# EAGLE board robotsm20-linefollower (EAGLE 9.6.0)
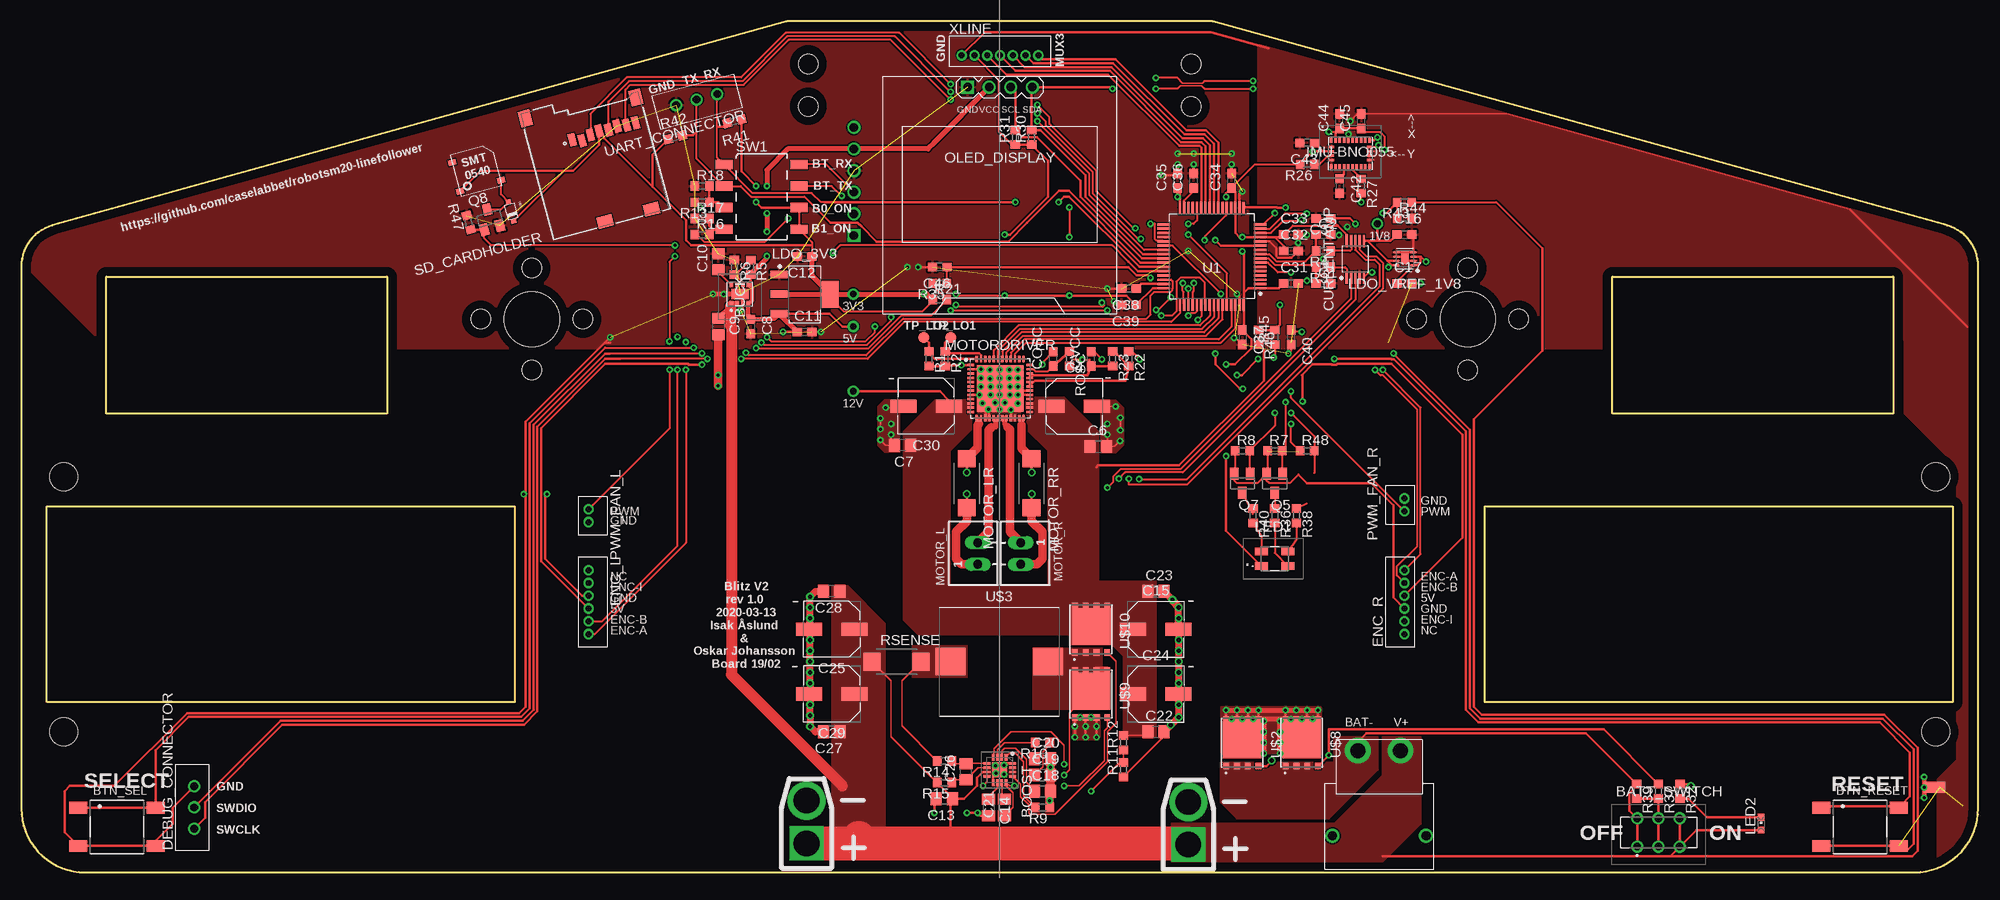
[diagram p4: board, top side]
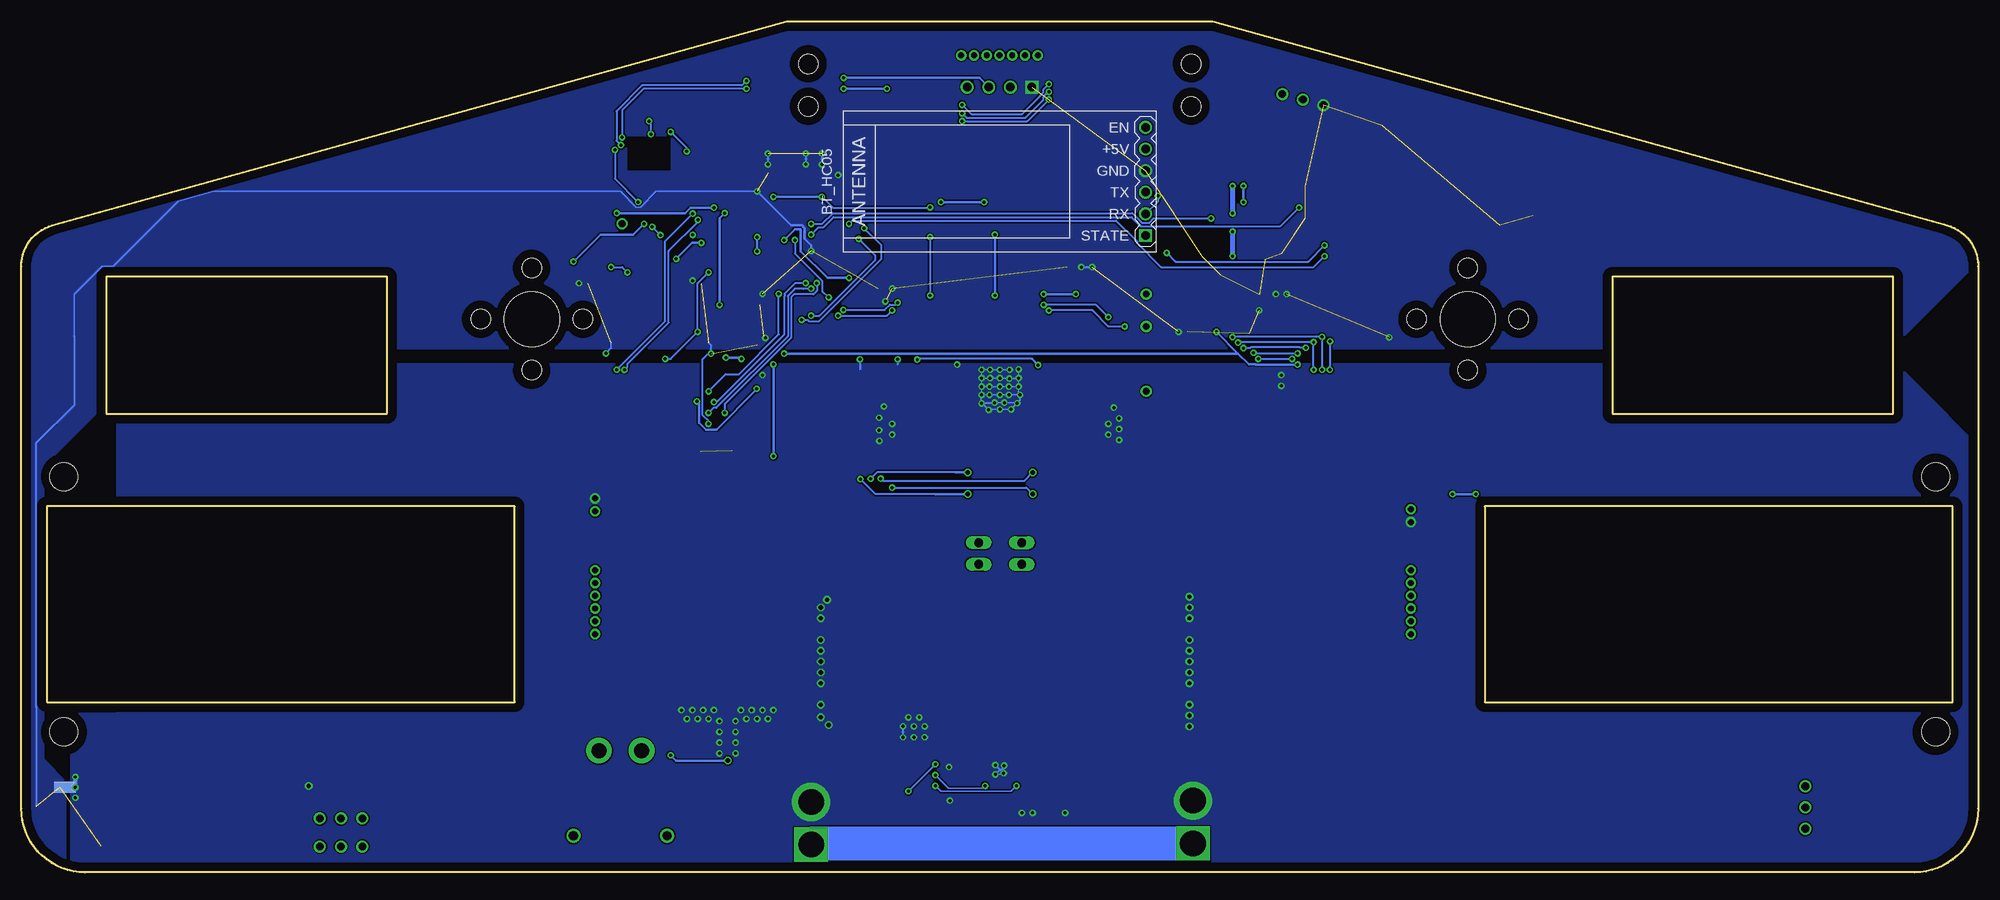
[diagram p5: board, bottom side, seen from below]

Size 230 x 100 mm. Coordinates in mm from the lower left corner, seen from the top.
Outline: 3.66,76.02 arc74 0,71.2 0,7.5 arc90 7.5,0 222.5,0 arc90 230,7.5 230,71.2 arc74 226.34,76.02 140,100 90,100 3.66,76.02
Outline: 58,20 3,20 3,43 58,43 58,20
Outline: 10,53.9 10,70 43,70 43,53.9 10,53.9
Outline: 220,70 220,53.9 187,53.9 187,70 220,70
Outline: 227,43 227,20 172,20 172,43 227,43
Copper layers (1*16): Top 0.035mm / dielectric 1.5mm / Bottom 0.035mm
Design rules "default": minimum track width 6mil, minimum drill 0.35mm, track to track 6mil, track to pad 6mil, pad to pad 6mil, via to via 6mil, smd to smd 6mil, copper to edge 40mil, drill to drill 6mil, minimum pad ring 10mil, minimum via ring 8mil, stop-mask expansion 4mil, vias tented up to drill 0mil, thermal gap 10mil
Holes 3.3 mm at 5,46.5 225,16.5 5,16.5 225,46.5
Holes 2.3 mm at 164,65 92.5,90 137.5,90 170,59 170,71 92.5,95 176,65 137.5,95 54,65 66,65 60,59 60,71
Holes 6.5 mm at 170,65 60,65
tRestrict: area 154.4,83.4 to 158,85.5
bRestrict: area 153.7,82.5 to 158.8,86.4

## Footprints (pad centres in the part's own frame; a part is rotated, then mirrored left to right if it is on the bottom)
JS202011AQN = drill 0.9 pad 1.4: 1 -2.5,-1.425; 2 0,-1.425; 3 2.5,-1.425; 4 -2.5,1.875; 5 0,1.875; 6 2.5,1.875
QFN50P300X300X80-17N = smd 0.8 x 0.3: 1 -1.5,0.75; 2 -1.5,0.25; 3 -1.5,-0.25; 4 -1.5,-0.75; 9 1.5,-0.75; 10 1.5,-0.25; 11 1.5,0.25; 12 1.5,0.75 | smd 0.3 x 0.8: 5 -0.75,-1.5; 6 -0.25,-1.5; 7 0.25,-1.5; 8 0.75,-1.5; 13 0.75,1.5; 14 0.25,1.5; 15 -0.25,1.5; 16 -0.75,1.5 | smd 1.76 x 1.76: 17 0,0
WIRELESS-BLUETOOTH-HC-05 = drill 1 square: 1 -6.35,-17.145 | drill 1: 2 -3.81,-17.145; 3 -1.27,-17.145; 4 1.27,-17.145; 5 3.81,-17.145; 6 6.35,-17.145
TSM2JSMA = smd 2.1 x 1.4: 1 -4.55,2.25; 2 4.55,2.25; 3 -4.55,-2.25; 4 4.55,-2.25
TPS82130SILT = smd 0.51 x 0.41: 1 -1.05,0.975; 2 -1.05,0.325; 3 -1.05,-0.325; 4 -1.05,-0.975; 5 1.05,-0.975; 6 1.05,-0.325; 7 1.05,0.325; 8 1.05,0.975 | smd 1.2 x 2: 9 0,0
C0603 = smd 1.1 x 1: 1 -0.85,0; 2 0.85,0
CAPAE660X700N = smd 3.062 x 1.562: 1 -2.675,0; 2 2.675,0
C0805 = smd 1.3 x 1.5: 1 -0.95,0; 2 0.95,0
SOP50P490X110-10N = smd 1.471 x 0.28: 1 -2.15,1; 2 -2.15,0.5; 3 -2.15,0; 4 -2.15,-0.5; 5 -2.15,-1; 6 2.15,-1; 7 2.15,-0.5; 8 2.15,0; 9 2.15,0.5; 10 2.15,1
B3B-EH = drill 0.9: 1 -2.5,0; 2 0,0; 3 2.5,0
B6B-ZR = drill 0.7: 1 -3.75,0; 2 -2.25,0; 3 -0.75,0; 4 0.75,0; 5 2.25,0; 6 3.75,0
XT30 = drill 3 pad 4.5: NEG- 0,5 | drill 3 pad 4 square: POS+ 0,0
BNO055 = smd 0.3 x 0.6: 1 -2.25,1.55; 6 -2.25,-1.55; 7 -1.75,-1.55; 8 -1.25,-1.55; 9 -0.75,-1.55; 10 -0.25,-1.55; 11 0.25,-1.55; 12 0.75,-1.55; 13 1.25,-1.55; 14 1.75,-1.55; 15 2.25,-1.55; 20 2.25,1.55; 21 1.75,1.55; 22 1.25,1.55; 23 0.75,1.55; 24 0.25,1.55; 25 -0.25,1.55; 26 -0.75,1.55; 27 -1.25,1.55; 28 -1.75,1.55 | smd 0.6 x 0.3: 2 -2.25,0.75; 3 -2.25,0.25; 4 -2.25,-0.25; 5 -2.25,-0.75; 16 2.25,-0.75; 17 2.25,-0.25; 18 2.25,0.25; 19 2.25,0.75
SOT230P700X180-4 = smd 1.965 x 0.889: 1 -3.023,2.3; 2 -3.023,0; 3 -3.023,-2.3 | smd 1.965 x 3.189: 4 3.023,0
SON50P200X200X80-9T80X120N = smd 0.711 x 0.27: 1 -1.001,0.75; 2 -1.001,0.25; 3 -1.001,-0.25; 4 -1.001,-0.75; 5 1.001,-0.75; 6 1.001,-0.25; 7 1.001,0.25; 8 1.001,0.75 | smd 0.8 x 1.2: 9 0,0
150141M173100 = smd 1.5 x 0.9: 1 1.55,0.85; 2 1.55,-0.85; 3 -1.55,0.85; 4 -1.55,-0.85
CHIPLED_0603 = smd 0.8 x 0.8: A 0,-0.75; C 0,0.75
JST-XH-02 = drill 1.016 long: 1 -1.27,0; 2 1.27,0
R2512W = smd 2 x 2.1: 1 -2.896,0; 2 2.896,0
QFN50P700X700X100-49T550N = smd 0.761 x 0.27: 1 -3.476,2.75; 2 -3.476,2.25; 3 -3.476,1.75; 4 -3.476,1.25; 5 -3.476,0.75; 6 -3.476,0.25; 7 -3.476,-0.25; 8 -3.476,-0.75; 9 -3.476,-1.25; 10 -3.476,-1.75; 11 -3.476,-2.25; 12 -3.476,-2.75; 25 3.476,-2.75; 26 3.476,-2.25; 27 3.476,-1.75; 28 3.476,-1.25; 29 3.476,-0.75; 30 3.476,-0.25; 31 3.476,0.25; 32 3.476,0.75; 33 3.476,1.25; 34 3.476,1.75; 35 3.476,2.25; 36 3.476,2.75 | smd 0.27 x 0.761: 13 -2.75,-3.476; 14 -2.25,-3.476; 15 -1.75,-3.476; 16 -1.25,-3.476; 17 -0.75,-3.476; 18 -0.25,-3.476; 19 0.25,-3.476; 20 0.75,-3.476; 21 1.25,-3.476; 22 1.75,-3.476; 23 2.25,-3.476; 24 2.75,-3.476; 37 2.75,3.476; 38 2.25,3.476; 39 1.75,3.476; 40 1.25,3.476; 41 0.75,3.476; 42 0.25,3.476; 43 -0.25,3.476; 44 -0.75,3.476; 45 -1.25,3.476; 46 -1.75,3.476; 47 -2.25,3.476; 48 -2.75,3.476 | smd 5.5 x 5.5: 49 0,0
DISPLAY-OLED-128X64-I2C = drill 1 square: 1 -3.81,12.7 | drill 1: 2 -1.27,12.7; 3 1.27,12.7; 4 3.81,12.7
B2B-ZR = drill 0.7: 1 -0.75,0; 2 0.75,0
SOT23 = smd 1 x 1.4: 1 -0.95,-1.1; 2 0.95,-1.1; 3 0,1.1
R0603 = smd 1 x 1.1: 1 -0.85,0; 2 0.85,0
693071010811 = smd 0.8 x 1.5: 1 1.94,-3.1; 2 0.84,-2.7; 3 -0.26,-3.1; 4 -1.36,-3.3; 5 -2.46,-3.1; 6 -3.56,-3.3; 7 -4.66,-3.1; 8 -5.76,-3.1 | smd 1.4 x 1.9: 9 6.6,-6.95; 9-1 -6.55,-5.95 | smd 1.8 x 1.4: 10 0.7,7.2; 10-1 -4.95,7.2
DIPSWITCH_4P_SMD = smd 1.1 x 2: A1 -3.81,4.4; A2 -1.27,4.4; A3 1.27,4.4; A4 3.81,4.4; B1 -3.81,-4.4; B2 -1.27,-4.4; B3 1.27,-4.4; B4 3.81,-4.4
PAD_HOLE = drill 0.8: P$1 0,0
PAD.03X.05 = smd 1.27 x 1.27: P$1 0,0
LQFP-64 = smd 1.469 x 0.28: 1 -5.671,3.75; 2 -5.671,3.25; 3 -5.671,2.75; 4 -5.671,2.25; 5 -5.671,1.75; 6 -5.671,1.25; 7 -5.671,0.75; 8 -5.671,0.25; 9 -5.671,-0.25; 10 -5.671,-0.75; 11 -5.671,-1.25; 12 -5.671,-1.75; 13 -5.671,-2.25; 14 -5.671,-2.75; 15 -5.671,-3.25; 16 -5.671,-3.75; 33 5.671,-3.75; 34 5.671,-3.25; 35 5.671,-2.75; 36 5.671,-2.25; 37 5.671,-1.75; 38 5.671,-1.25; 39 5.671,-0.75; 40 5.671,-0.25; 41 5.671,0.25; 42 5.671,0.75; 43 5.671,1.25; 44 5.671,1.75; 45 5.671,2.25; 46 5.671,2.75; 47 5.671,3.25; 48 5.671,3.75 | smd 0.28 x 1.469: 17 -3.75,-5.671; 18 -3.25,-5.671; 19 -2.75,-5.671; 20 -2.25,-5.671; 21 -1.75,-5.671; 22 -1.25,-5.671; 23 -0.75,-5.671; 24 -0.25,-5.671; 25 0.25,-5.671; 26 0.75,-5.671; 27 1.25,-5.671; 28 1.75,-5.671; 29 2.25,-5.671; 30 2.75,-5.671; 31 3.25,-5.671; 32 3.75,-5.671; 49 3.75,5.671; 50 3.25,5.671; 51 2.75,5.671; 52 2.25,5.671; 53 1.75,5.671; 54 1.25,5.671; 55 0.75,5.671; 56 0.25,5.671; 57 -0.25,5.671; 58 -0.75,5.671; 59 -1.25,5.671; 60 -1.75,5.671; 61 -2.25,5.671; 62 -2.75,5.671; 63 -3.25,5.671; 64 -3.75,5.671
SMT-0540-S-R = smd 0.7 x 0.9: + 1.9,-2.4; - 1.9,2.6; DUMMY_LEAD -1.6,-2.4
Q5A = smd 0.75 x 0.675: 1 2.752,-1.905; 2 2.752,-0.635; 3 2.752,0.635; 4 2.752,1.905 | smd 0.655 x 0.675: 5 -2.8,1.905; 6 -2.8,0.635; 7 -2.8,-0.635; 8 -2.8,-1.893 | smd 4.295 x 4.51: 9 -0.325,0
INDM135125X330N = smd 3.533 x 3.21: 1 -5.736,0; 2 5.736,0
SPLITTER = smd 1.27 x 1.27: P$1 0,0.635; P$2 0,-0.635
1N4148WX_SOD-323-2 = smd 0.6 x 0.6: + -0.935,-0.035; - 1.365,-0.035
XT30PW-M = drill 1.8 pad 3: + -2.5,0; - 2.5,0 | drill 1.1: NC$1 5.5,10; NC$2 -5.5,10
B7B-ZR = drill 0.7: 1 -4.5,0; 2 -3,0; 3 -1.5,0; 4 0,0; 5 1.5,0; 6 3,0; 7 4.5,0

## Placement (x,y rotation side)
BATT_SWITCH  JS202011AQN  [JS202011AQN]  192.42,4.45 0 top
BOOST  TPS43061RTER  [QFN50P300X300X80-17N]  114.99,12.04 270 top
BT_HC05  WIRELESS-BLUETOOTH-HC-05  [WIRELESS-BLUETOOTH-HC-05]  115,81.18 90 bottom
BTN_RESET  TSM2JSMA  [TSM2JSMA]  216.1,5.35 0 top
BTN_SEL  TSM2JSMA  [TSM2JSMA]  11.23,5.35 0 top
BUCK  TPS82130SILT  [TPS82130SILT]  84.45,67.94 90 top
C1  4.7nF  [C0603]  153.03,69.22 0 top
C2  4.7nF  [C0603]  153.03,74.93 0 top
C3  0.1µF  [C0603]  153.03,76.83 180 top
C4  100uF  [CAPAE660X700N]  123.75,54.76 0 top
C6  0.1µF  [C0805]  126.58,50.04 0 top
C7  0.1µF  [C0805]  103.58,50.17 180 top
C8  10µF  [C0603]  85.72,64.14 270 top
C9  22µF  [C0805]  81.92,64.14 270 top
C10  3300pF  [C0805]  81.92,71.75 90 top
C11  10µF  [C0603]  92.08,63.5 0 top
C12  10µF  [C0603]  92.08,72.39 180 top
C13  0.1µF  [C0805]  108.48,8.64 180 top
C14  4.7µF  [C0805]  113.67,7.62 270 top
C15  100uF  [CAPAE660X700N]  133.35,28.57 0 top
C16  300pF  [C0603]  162.56,74.93 0 top
C17  10µF  [C0603]  162.56,69.22 0 top
C18  0.1µF  [C0805]  120.02,9.53 0 top
C19  1.5nF  [C0805]  120.02,11.43 0 top
C20  110pF  [C0805]  120.02,13.34 0 top
C21  100nF  [C0805]  115.57,7.62 90 top
C22  22µF  [C0805]  133.35,16.51 0 top
C23  22µF  [C0805]  133.35,33.02 0 top
C24  100uF  [CAPAE660X700N]  133.35,20.95 0 top
C25  100uF  [CAPAE660X700N]  95.25,28.57 180 top
C26  100pF  [C0805]  111.02,11.81 90 top
C27  22µF  [C0805]  95.25,16.51 180 top
C28  22µF  [C0805]  95.25,33.02 180 top
C29  100uF  [CAPAE660X700N]  95.25,20.95 180 top
C30  100uF  [CAPAE660X700N]  106.35,54.76 180 top
C31  0.1u  [C0603]  149.22,69.22 0 top
C32  0.1u  [C0603]  149.22,73.03 0 top
C33  1u  [C0603]  149.22,74.93 0 top
C34  0.1u  [C0603]  142.24,81.28 90 top
C35  0.1u  [C0603]  135.89,81.28 90 top
C36  2.2u  [C0603]  137.79,81.28 90 top
C37  0.1u  [C0603]  143.51,62.87 270 top
C38  2.2u  [C0603]  130.18,68.58 180 top
C39  0.1u  [C0603]  130.18,66.67 180 top
C40  0.1u  [C0603]  149.22,62.87 270 top
C42  100nF  [C0603]  154.94,80.64 270 top
C43  100nF  [C0603]  151.13,85.72 180 top
C44  120nF  [C0603]  154.94,88.27 90 top
C45  6.8nF  [C0603]  157.48,88.27 90 top
C46  0.1u  [C0603]  107.95,71.12 180 top
COSC  270pF  [C0603]  121.28,60.33 90 top
CURRENTAMP  INA2181  [SOP50P490X110-10N]  156.79,72.06 90 top
CVCC  0.1µF  [C0603]  125.73,60.33 90 top
DEBUG_CONNECTOR  JST-EH-03  [B3B-EH]  20.32,7.62 90 top
ENC_L  ZH-6  [B6B-ZR]  66.67,31.75 270 top
ENC_R  ZH-6  [B6B-ZR]  162.56,31.75 90 top
FAN_POWER_L  XT30  [XT30]  137.17,3.28 0 top
FAN_POWER_R  XT30  [XT30]  92.29,3.42 0 top
IMU-BNO055  BNO055  [BNO055]  156.21,84.45 0 top
LDO_3V3  LM1117-3.3  [SOT230P700X180-4]  92.08,67.94 0 top
LDO_VREF_1V8  MCP1501T-XXE  [SON50P200X200X80-9T80X120N]  162.61,72.08 180 top
LED1  150141M173100  [150141M173100]  147.32,36.83 180 top
LED2  [CHIPLED_0603]  204.47,5.71 0 top
MOTOR_L  XH-02  [JST-XH-02]  112.39,37.47 90 top
MOTOR_LR  R001  [R2512W]  111.12,45.72 270 top
MOTOR_R  XH-02  [JST-XH-02]  117.47,37.47 270 top
MOTOR_RR  R001  [R2512W]  118.75,45.72 270 top
MOTORDRIVER  TB67H420FTG  [QFN50P700X700X100-49T550N]  115.05,56.85 0 top
OLED_DISPLAY  DISPLAY-OLED-128X64-I2C  [DISPLAY-OLED-128X64-I2C]  115.02,79.55 0 top
PWM_FAN_L  ZH  [B2B-ZR]  66.67,41.91 270 top
PWM_FAN_R  ZH  [B2B-ZR]  162.56,43.18 90 top
Q5  BSS138LT3G  [SOT23]  147.32,45.72 180 top
Q7  BSS138LT3G  [SOT23]  143.51,45.72 180 top
Q8  BSS138LT3G  [SOT23]  55.05,76.83 15 top
R1  10k  [R0603]  106.68,60.33 270 top
R2  10k  [R0603]  108.58,60.33 270 top
R3  100R  [R0603]  153.03,71.12 180 top
R4  100R  [R0603]  153.03,73.03 180 top
R5  105k  [R0603]  85.72,71.12 270 top
R6  20k  [R0603]  83.82,71.12 270 top
R7  10k  [R0603]  147.32,49.53 0 top
R8  10k  [R0603]  143.51,49.53 0 top
R9  75k  [R0603]  120.02,7.62 180 top
R10  15.4k  [R0603]  120.02,15.24 180 top
R11  10k  [R0603]  129.54,12.06 90 top
R12  88k  [R0603]  129.54,15.24 90 top
R13  10k  [R0603]  80.01,78.74 180 top
R14  10R  [R0603]  108.48,13.08 180 top
R15  10R  [R0603]  108.48,10.54 180 top
R16  10k  [R0603]  80.01,74.93 0 top
R17  10k  [R0603]  80.01,76.83 0 top
R18  10k  [R0603]  80.01,80.64 0 top
R21  10k  [R0603]  107.95,67.31 0 top
R22  19.4k  [R0603]  130.18,60.33 270 top
R23  10k  [R0603]  128.27,60.33 270 top
R26  10k  [R0603]  151.13,83.19 180 top
R27  10k  [R0603]  157.48,80.64 270 top
R30  10k  [R0603]  118.75,86.36 90 top
R31  10k  [R0603]  116.84,86.36 90 top
R32  300R  [R0603]  194.94,9.53 270 top
R35  10k  [R0603]  107.95,69.22 180 top
R36  50R  [R0603]  147.32,41.91 270 top
R37  100R  [R0603]  192.41,9.53 270 top
R38  0R  [R0603]  149.86,41.91 270 top
R39  10k  [R0603]  189.87,9.53 270 top
R40  0R  [R0603]  144.78,41.91 270 top
R41  10k  [R0603]  83.82,88.27 195 top
R42  10k  [R0603]  76.83,86.36 15 top
R43  20k  [R0603]  162.56,78.74 180 top
R44  10k  [R0603]  162.56,76.83 0 top
R45  10k  [R0603]  147.32,62.87 90 top
R46  62k  [R0603]  145.41,62.87 270 top
R47  10k  [R0603]  52.59,76.35 105 top
R48  10k  [R0603]  151.13,49.53 0 top
ROSC  3.14k  [R0603]  123.19,60.33 270 top
RSENSE  R002  [R2512W]  102.87,24.77 0 top
SD_CARDHOLDER  [693071010811]  67.44,83.59 195 top
SW1  CTS_219-4LPST  [DIPSWITCH_4P_SMD]  87,79.38 270 top
TP_1V8  TEST_POINTPAD_HOLE  [PAD_HOLE]  159.38,76.2 0 top
TP_3V3  TEST_POINTPAD_HOLE  [PAD_HOLE]  97.79,67.94 0 top
TP_5V  TEST_POINTPAD_HOLE  [PAD_HOLE]  97.79,64.14 0 top
TP_12V  TEST_POINTPAD_HOLE  [PAD_HOLE]  97.79,56.52 0 top
TP_LO1  TEST-POINT3X5  [PAD.03X.05]  109.22,62.87 0 top
TP_LO2  TEST-POINT3X5  [PAD.03X.05]  106.05,62.87 0 top
U1  STM32F405RG  [LQFP-64]  139.93,72.39 180 top
U$1  SMT-0540-S-R  [SMT-0540-S-R]  53.38,82.47 285 top
U$2  CSD17301Q5A  [Q5A]  143.51,15.24 270 top
U$3  0.68µH  [INDM135125X330N]  114.94,24.77 0 top
U$4  SPLITTER  [SPLITTER]  224.87,9.98 270 top
U$5  DIODE_1N4148WX  [1N4148WX_SOD-323-2]  57.55,77.87 285 top
U$6  SPLITTER  [SPLITTER]  224.87,9.98 90 bottom
U$8  CSD17301Q5A  [Q5A]  150.5,15.24 270 top
U$9  CSD17301Q5A  [Q5A]  125.73,20.95 270 top
U$10  CSD17301Q5A  [Q5A]  125.73,28.57 270 top
U$15  XT30PW-M  [XT30PW-M]  159.59,14.29 180 top
UART_CONNECTOR  JST-EH-03  [B3B-EH]  79.38,90.81 195 top
XLINE  ZH  [B7B-ZR]  115.03,95.99 0 top

## Tracks (layer width: path | path; a pad name or v marks a point on that pad's centre or on a via)
!RESET  (via drill 0.35)
  Top 0.254: v150.5,63.5 149.44,63.5 C40.1 | v149.22,70.48 147.68,70.48 146.53,71.64 U1.7
  Top 0.3: v154.31,60.33 160.99,60.33 161.01,60.3 161.31,60.3 169.8,51.81 169.8,19.09 171.27,17.62 218.44,17.62 221.98,14.08 221.98,8.93 220.83,7.77 | 220.83,7.77 BTN_RESET.2 | BTN_RESET.1 211.73,7.77 220.83,7.77
  Bottom 0.254: v154.31,60.33 153.67,60.33 v150.5,63.5 150.5,69.22 v149.22,70.48
+3V3  (via drill 0.35)
  Top 0.254: R21.1 107.1,67.11 105.88,65.89 96.67,65.89 94.61,67.94 | SW1.A3 SW1.A4 92.92,74.03 92.92,73.66 C12.1 | 57.72,76.39 U$5.- | C34.1 145,83.19 R26.2 | v160.23,84.88 160.18,84.93 160.18,86.5 159.66,87.02 157.88,87.02 C45.1 | v157.48,78.76 R27.2 | C33.1 149.44,75.99 154.73,75.99 | v123.19,78.13 v123.19,74.64 | 154.46,86.94 153.73,86.94 v153.67,87
  Top 0.3: IMU-BNO055.3 153,84.7 | 153,84.7 C43.1 | 153,84.7 v151.8,84.7 R26.2 | IMU-BNO055.28 154.46,86.94 C44.1 C45.1 | C31.1 147.79,68.64 U1.1 144.2,68.64 143.68,68.12 | U1.19 142.68,78.11 | 142.68,78.11 142.68,79.99 C34.1 141.6,79.8 v141.6,79.38 | U1.32 136.18,80.01 | 136.18,80.01 136.18,80.14 C35.1 | U1.48 132.99,68.64 C39.1 129.92,67.78 v123.19,67.78 v115.57,67.78 110.02,67.78 v109.86,67.94 | 147.32,74.64 U1.13 v143.51,74.64 143.17,74.64 142.68,75.12 142.68,78.11 | 147.32,74.64 148.08,74.64 C33.1 | 147.32,74.64 148.38,73.58 C32.1 | C17.1 161.61,69.33 LDO_VREF_1V8.1 164.07,71.33 164.43,71.69 164.43,72.17 164.26,72.34 164.26,72.33 LDO_VREF_1V8.3 164.52,72.33 v165.1,71.75 | CURRENTAMP.10 155.79,74.93 154.73,75.99 C3.1 156.16,76.83 v156.8,76.2 | TP_3V3.P$1 LDO_3V3.4 | 63.79,82.46 U$5.- | 92.92,73.66 78.74,73.66 78.11,74.3 78.11,76.65 74.2,80.55 | 74.2,80.55 68.51,86.24 68.51,86.38 67.9,87 67.9,85.5 64.86,82.46 63.79,82.46 | R42.1 74.2,84.33 74.2,80.55 | R41.1 84.64,82.36 v86.36,80.64 | v86.36,78.74 87,78.11 SW1.A3 | XLINE.2 114.94,93.08 114.94,87 116.42,85.51 R31.1 R30.1 120.65,83.61 120.65,79.38 116.2,74.93 v115.57,74.93 | U$1.+ 54.01,82.46 63.79,82.46 | v135.89,79.38 135.89,79.72 136.18,80.01 | 143.68,68.12 U1.64 143.68,63.89 C37.1 144.56,62.66 144.56,61.59 142.66,59.69 v141.6,59.69 | 143.68,68.12 143.68,72.78 v143.51,72.95 | LED1.1 141.6,40.15 v141.6,48.9
  Top 0.305: 67.9,87 SD_CARDHOLDER.4
  Top 0.6: LDO_3V3.2 94.61,67.94 LDO_3V3.4 92.92,70.12 C12.1
  Top 0.61: LDO_3V3.4 v106.05,67.94 106.47,67.94 R21.1
  Bottom 0.254: v160.23,84.88 160.23,81.52 v157.48,78.76 | v135.89,79.38 134.62,78.11 123.21,78.11 v123.19,78.13 | v123.19,74.64 v123.19,67.78 | v153.67,87 151.8,85.12 v151.8,84.7
  Bottom 0.3: v86.36,80.64 v86.36,78.74 | v109.86,67.94 v106.05,67.94 | v115.57,74.93 v115.57,67.78 | v141.6,79.38 v135.89,79.38 | v143.51,72.95 v143.51,74.64 | v141.6,48.9 v141.6,59.69 | v165.1,71.75 161.93,74.93 158.07,74.93 v156.8,76.2
+5V  (via drill 0.35)
  Top 0.3: R5.2 85.72,69.29 85.69,69.25 BUCK.5 | TP_5V.P$1 96.52,64.14 95.01,65.64 89.08,65.64 | ENC_L.4 61.1,36.57 61.1,52.19 68.64,59.74 78.39,59.74 78.45,59.67 v80.01,59.67 | v89.53,63.5 C11.1 | ENC_R.4 169.35,39.29 169.35,51.44 161.05,59.74 154.68,59.74 154.59,59.64 154.02,59.64 153.98,59.69 151.76,59.69 150.5,58.42 150.59,58.33 v150.59,55.34 | v143.56,56.82 143.21,56.82 140.34,59.69 v140.34,60.96
  Top 0.508: C8.1 85.43,65.38 BUCK.4 85.47,66.94 85.62,66.94 85.86,67.18 85.86,68.71 85.69,68.89 85.69,69.25
  Top 0.6: C8.1 88.49,65.08 LDO_3V3.3 89.08,65.64 C11.1
  Top 0.61: OLED_DISPLAY.2 107.31,85.81 107.31,85.72 106.58,84.99 BT_HC05.5 90.07,84.99 87.63,82.55 v87.63,80.64 | v87.63,77.42 v87.63,75.28 | v87.63,72.41 87.63,72.17 R5.2
  Bottom 0.3: v80.01,59.67 80.34,59.67 80.36,59.64 84.9,59.64 84.95,59.69 85.72,59.69 87,60.96 | 87,60.96 v89.53,63.5 | 87,60.96 v140.34,60.96 | v150.59,55.34 150.34,55.09 150.34,52.83 149.53,52.02 148.31,52.02 143.56,56.77 v143.56,56.82
  Bottom 0.61: v87.63,80.64 v87.63,77.42 | v87.63,75.28 v87.63,72.41
+12V
  Top 0.203: C22.1 131.98,16.09 R12.2
  Top 0.3: R46.2 146.05,61.38 146.05,57.78 136.09,47.83 126.57,47.83 126.36,47.62 | TP_12V.P$1 107.95,56.52 109.03,55.44 C30.1
  pour Top (no thermals): 133.35,34.29 133.35,15.88 129.54,15.88 129.54,25.4 128.27,26.67 123.19,26.67 123.19,34.29
  pour Top: 105.41,33.66 105.41,27.94 124.46,27.94 124.46,33.66
  pour Top (no thermals): 109.22,31.75 109.22,49.53 111.76,52.07 111.76,55.52 107.39,55.52 103.66,51.79 103.66,29.69 105.41,27.94
  pour Top (no thermals): 118.11,55.88 122.56,55.88 126.62,51.82 126.62,31.37 126.36,31.11 121.92,31.11 120.65,32.38 120.65,49.53 118.11,52.07
AGND  (via drill 0.35)
  Top 0.152: IMU-BNO055.16 158.99,83.7 | IMU-BNO055.17 159.03,84.2 | IMU-BNO055.18 159.08,84.7 | C45.2 174.63,89.11 214.91,77.93 228.78,64.06
  Top 0.254: C2.2 154.83,74.93 v154.88,74.87 | IMU-BNO055.25 155.96,86.7 v155.99,86.73 | v156.21,88.27 157.06,89.11 C45.2
  Top 0.3: U1.12 146.7,74.14 146.71,74.14 147.52,73.33 147.52,72.4 147.7,72.22 149.27,72.22 C32.2 v150.07,73.97 150.07,74.3 | 150.07,74.3 C33.2 | LDO_VREF_1V8.2 162.86,71.83 LDO_VREF_1V8.9 162.36,72.33 LDO_VREF_1V8.6 | LDO_VREF_1V8.5 LDO_VREF_1V8.4 163.61,74.83 C16.2 | XLINE.1 113.25,98.71 139.82,98.71 146.59,96.83 | 150.07,74.3 150.68,74.9 v151.1,74.9
  Bottom 0.254: v154.88,74.87 v155.85,75.84 | v155.99,86.73 155.99,88.04 v156.21,88.27
  Bottom 0.3: v151.1,74.9 151.1,75.08 | v150.07,73.97 151.15,73.97 v153.03,72.08
  pour Top: 145.41,100.33 219.07,100.33 229.87,89.53 229.87,71.12 220.34,61.59 145.41,61.59
  pour Top: 221.13,64.47 230.73,74.07 230.73,74.3 230.89,74.45 232.56,74.45 232.56,4.95 226.77,-0.84 225.17,-0.84 225.17,10.9 227.46,13.18 227.46,47.78 221.13,54.1
BAT-
  Top 0.3: BATT_SWITCH.1 BATT_SWITCH.4 189.01,7.24 189.01,9.3 189.87,10.15 R39.1 183.89,16.35 158.12,16.35 157.09,15.33 U$15.-
  pour Top (no thermals): 159.38,15.88 159.38,12.06 153.67,6.35 142.88,6.35 140.97,8.26 140.97,12.88 154.31,12.88 154.31,15.88
BOOT0  (via drill 0.35)
  Top 0.254: U1.60 141.68,67.31 141.71,67.33 141.71,70.38 v137.16,74.93 | v79.83,78.11 79.8,78.11 R13.2
  Bottom 0.254: v137.16,74.93 136.3,75.79 135.72,75.79 134.54,76.97 99.5,76.97 98.46,75.93 82,75.93 v79.83,78.11
BOOT1  (via drill 0.35)
  Top 0.254: U1.28 138.18,77.45 138.18,77.44 138.18,77.42 138.2,77.39 138.2,76.61 137.79,76.2 v137.16,76.2 | R16.1 79.42,74.93 80.24,74.1 87.44,74.1 v90.17,76.83
  Bottom 0.254: v137.16,76.2 135.89,76.2 134.62,77.47 99.42,77.47 98.29,76.34 97.43,76.34 96.94,76.83 v90.17,76.83
BTN_SEL  (via drill 0.35)
  Top 0.254: R35.1 C46.1
  Top 0.3: v132.72,69.85 132.38,70.18 131.06,70.18 130.12,71.12 C46.1 | U1.11 141,73.64 v140.34,74.3
  Bottom 0.3: v132.72,69.85 135.25,69.85 138.38,72.98 138.38,75.52 138.43,75.56 139.06,75.56 v140.34,74.3
BUZZER  (via drill 0.35)
  Top 0.254: 130.15,71.73 128.22,73.66 96.24,73.66 v95.38,72.8 | v76.83,73.66 55.24,73.66 54.41,74.49 Q8.1
  Top 0.305: U1.44 131.25,70.64 130.15,71.73 | R47.1 54.4,75.53 Q8.1
  Bottom 0.254: v95.38,72.8 94.34,71.75 78.74,71.75 v76.83,73.66
COMP
  Top 0.203: C20.1 119.17,13.44 R10.2 115.57,15.24 114.74,14.41 BOOST.3
DGND  (via drill 0.35)  (30 unrouted)
  Top 0.254: 161.29,60.96 v161.29,60.98 | C17.2 v164.47,69.22 | C31.2 150.4,69.54 v151.1,69.54 | C40.2 149.22,61.26 v148.93,60.95 | 150.18,49.43 R48.1 149.25,50.56 v149.25,52.7 | 150.1,46.74 149.08,45.72 146.69,45.72 146.37,46.03 Q5.2 | Q5.2 145.27,45.72 142.88,45.72 142.56,46.03 Q7.2 142.66,46.92 R8.1 | R7.1 146.47,46.92 Q5.2 | C37.2 142.72,62.81 v142.54,62.81
  Top 0.3: 59.29,44.45 59.29,52.94 68.58,62.23 | 59.29,44.45 59.29,19.46 58.54,18.71 19.5,18.71 10.95,10.16 5.71,10.16 5.08,9.53 5.08,4.7 BTN_SEL.3 BTN_SEL.4 15.78,3.72 17.78,5.71 17.78,7.58 DEBUG_CONNECTOR.3 | 68.58,62.23 69.22,62.23 | 161.29,60.96 170.25,51.99 170.25,19.28 171.46,18.07 218.8,18.07 222.43,14.44 222.43,3.36 221.62,2.54 221.2,2.54 BTN_RESET.4 BTN_RESET.3 | ENC_L.3 65.92,32.5 61.55,36.87 61.55,44.41 61.59,44.45 v61.78,44.45 | v59.05,44.45 59.29,44.45 | ENC_R.3 161.25,32.31 161.25,43.14 158.66,45.72 151.13,45.72 150.1,46.74 | 68.58,62.23 v69.22,62.87 | C46.2 v105.41,71.12 | v142.24,83.19 C34.2 | C36.2 v137.79,83.19 | v135.89,83.19 C35.2 135.68,81.92 v133.99,81.92 | U1.63 143.18,67.67 v142.88,67.98 | U1.18 143.18,79.68 v143.51,80.01 | C38.2 v127.64,68.58 | C11.2 v93.98,63.5 | BUCK.9 84.78,67.62 BUCK.3 84.78,66.31 v84.51,66.04 | C39.2 128.86,66.67 v128.44,67.1
  Top 0.6: BUCK.9 v82.55,67.94 v81.28,67.94
  Bottom 0.152: v143.51,80.01 155.37,80.01 157.23,78.16 157.73,78.16 159.59,80.01 207.41,80.01 211.53,78.86 219.18,71.22 220.5,71.22 223.8,67.92 223.8,63.02
  Bottom 0.254: v161.29,60.98 160.66,61.62 160.66,62.23 | 149.22,62.23 148.93,61.93 v148.93,60.95 149.25,60.95 149.91,60.3 149.91,53.7 149.25,53.05 v149.25,52.7 | v142.54,62.81 142.7,62.97 | 223.8,63.02 223.8,54.86 228.27,50.39 228.27,19.47 228.22,19.42 228.22,7.77
  Bottom 0.3: v61.78,44.45 v59.05,44.45 | v105.41,71.12 v104.14,71.12 | v142.24,84.45 v142.24,83.19 | v137.79,83.19 v137.79,84.45 | v135.89,83.19 v135.89,84.45 | v142.88,67.98 142.88,67.94 | v137.16,73.03 137.16,73.66 137.93,74.43 137.93,75.71 138.24,76.02 139.52,76.02 v143.51,80.01 | v84.51,66.04 84.45,66.04 | v128.44,67.1 128.27,67.27 128.27,67.31
  pour Top: 11.43,100.33 144.15,100.33 144.15,61.59 10.16,61.59 0,71.75 0,88.9
  pour Bottom (no thermals): 12.7,101.6 217.81,101.6 229.87,89.53 229.87,71.12 220.34,61.59 10.16,61.59 0,71.75 0,88.9
  pour Bottom: 221.13,64.62 221.13,54.18 227.38,47.93 227.38,13.26 225.63,11.51 225.63,-0.76 226.77,-0.76 232.56,5.03 232.56,74.14 232.33,74.37 230.89,74.37
  pour Bottom: 221.13,64.62 221.13,54.03 227.38,47.78 227.38,13.26 224.79,10.67 224.79,-0.76 226.77,-0.76 232.56,5.03 232.56,74.14 232.33,74.37 230.89,74.37
ENC_L_A  (via drill 0.35)
  Top 0.254: ENC_L.6 67.37,28 78.11,38.73 v78.11,59.05 | v78.11,62.3 78.11,62.23 | v87,62.25 87.25,62 99.42,62 102.23,64.82 v102.23,65.23 | U1.21 141.6,77.98 141.6,77.21 139.06,74.67 v139.06,74.3 | v135.1,67.55 133.63,66.08 v133.37,66.08 | v127,66.95 127.31,66.64 127.11,66.45 110.08,66.45 v109.86,66.67
  Bottom 0.254: v78.11,59.05 v78.11,62.3 86.95,62.3 v87,62.25 | v135.1,67.55 135.86,68.3 135.86,69.5 139.06,72.7 v139.06,74.3 | v127,66.95 127.25,66.7 127.91,66.7 128.53,66.08 v133.37,66.08 | v109.86,66.67 103.68,66.67 v102.23,65.23
ENC_L_B  (via drill 0.35)
  Top 0.254: ENC_L.5 68.23,29.5 77.11,38.37 v77.11,59.05 | v87.65,62.88 88.12,62.41 99.25,62.41 100.33,63.49 v100.33,64.14 | U1.55 139.1,66.79 139.1,69.27 138.52,69.85 138.1,69.85 138.07,69.88 136.25,69.88 135.76,69.4 135.76,65.91 135.25,65.41 v133.99,65.41 | v109.22,66.02 110.13,66.02 110.15,66.04 v127.64,66.04
  Bottom 0.254: v77.11,59.05 v77.11,62.91 77.78,62.91 77.83,62.96 87.58,62.96 v87.65,62.88 | v133.99,65.41 128.27,65.41 v127.64,66.04 | v100.33,64.14 102.23,64.14 104.12,66.02 v109.22,66.02
ENC_R_A  (via drill 0.35)
  Top 0.254: ENC_R.6 164.47,37.41 164.47,54.61 v160.02,59.05 | v151.08,77.39 148.51,77.39 146.75,75.64 U1.15
  Bottom 0.254: v160.02,59.05 154.31,64.77 154.31,74.17 v151.08,77.39
ENC_R_B  (via drill 0.35)
  Top 0.254: ENC_R.5 161.68,34.88 161.68,35.95 164.06,38.33 164.06,54.38 160.04,58.4 159.75,58.4 v159.11,59.03 | v150.48,76.66 150.32,76.51 148.26,76.51 146.89,75.14 U1.14
  Bottom 0.254: v159.11,59.03 158.75,59.4 158.75,59.75 153.9,64.6 153.9,73.03 150.48,76.45 v150.48,76.66
GND  (via drill 0.35, 0.5)
  Top 0.152: C30.2 103.52,54.61 v101.6,54.61 | v100.97,53.34 v100.97,52.07 | v100.97,50.8 101.6,50.16 C7.2 102.23,50.57 v102.23,51.44 | C4.2 128.6,54.76 v128.63,54.74 | v129.18,53.42 v129.18,51.94 | v129.13,50.7 128.47,50.04 C6.2 127.64,50.14 v127.64,51.44 | MOTORDRIVER.49 115.21,56.69 | 115.21,56.69 | v113.88,58.02 112.8,59.1 v112.78,59.1 | MOTORDRIVER.49 v113.88,58.02 | v113.88,58.02 113.84,58.06 v113.84,59.05 | MOTORDRIVER.49 114.3,56.1 | 114.3,56.1 v112.62,56.1 | MOTORDRIVER.49 114.3,56.1 | 114.3,56.1 113.54,56.1 | MOTORDRIVER.16 113.67,53.51 v113.67,54.41 | MOTORDRIVER.49 115.05,56.53 | 116.59,53.38 116.3,53.66 v116.3,54.33 | 118.03,56.1 | 118.03,56.1 v117.12,56.1 | v114.54,11.64 115.11,12.22 | v112.78,57.07
  Top 0.203: BOOST.16 115.98,12.79 115.57,12.79 | BOOST.17 v114.49,12.54
  Top 0.254: R45.1 147.32,60.33 v147.17,60.47 | v131.44,60.28 130.81,60.91 R22.1 | COSC.2 120.02,59.91 v120.02,59.67 | CVCC.2 126.1,61.17 v127,60.28
  Top 0.3: C14.2 112.71,6.67 v112.39,6.99 v111.12,6.99 | MOTORDRIVER.15 113.67,53.38 MOTORDRIVER.16 | R32.1 196,10.38 v196.22,10.16 | MOTORDRIVER.2 v112.78,59.1 112.98,59.1 113.03,59.05 v113.84,59.05 114.3,59.05 114.94,58.42 114.94,56.97 MOTORDRIVER.49 | MOTORDRIVER.29 118.03,56.1 v117.12,56.1 115.8,56.1 115.3,56.6 | 117.47,56.6 MOTORDRIVER.30 117.47,56.6 | 117.47,56.6 115.3,56.6 | 115.21,56.69 115.3,56.6 | MOTORDRIVER.8 v112.62,56.1 113.54,56.1 v113.92,56.1 114.8,56.1 115.3,56.6 | U$8.8 147.96,18.04 | 146.05,18.04 147.96,18.04 | 146.05,18.04 U$2.5 | 146.05,18.04 v146.05,17.78 | 147.96,18.04 v147.96,17.78 | v147.96,15.24 v147.96,13.97 | U$2.5 v145.41,19.05 | U$2.6 v144.15,19.05 | U$2.7 v142.88,19.05 | v141.6,19.05 141.6,18.05 U$2.8 v142.24,18.04 v143.51,18.04 | U$8.8 148.59,18.05 v148.59,19.05 | U$8.6 v151.13,19.05 | v152.4,19.05 U$8.5 v151.76,18.04 v150.5,18.04 | v143.51,18.04 v144.78,18.04 U$2.5 | v149.22,18.04 v150.5,18.04 | U$8.7 v149.22,18.04 | v149.22,18.04 U$8.8 | BOOST.17 114.99,12.09 115.11,12.22 v115.51,12.61 | v126.36,15.88 v126.36,17.14 U$9.3 v125.73,18.2 v124.46,18.2 U$9.1 v123.83,17.14 v123.83,15.88 | U$9.2 v125.09,17.14 v125.09,15.88 | R11.1 134.3,15.97 C22.2 | C13.2 107.31,8.42 v107.31,6.99 | v145.37,60.33 143.46,58.42 v142.88,58.42 | 117.47,56.6 | C25.2 92.71,28.44 v92.71,27.3 | C29.2 92.58,22.09 v92.71,22.23 | U$2.9 v143.51,18.04 | U$8.9 v150.5,18.04
  Top 0.305: MOTORDRIVER.15 113.3,54.25 113.67,54.61 v113.67,54.41 113.67,53.38 | MOTORDRIVER.22 116.59,53.38 MOTORDRIVER.21 v116.3,54.33 | BOOST.9 114.24,11.34 v114.54,11.64 | BOOST.16 | BOOST.16 115.57,12.79 | 115.98,12.79 115.8,12.61 v115.51,12.61
  Top 0.508: U$6.P$2 v223.65,9.98 | v223.65,11.2 v223.65,8.76
  Top 0.6: 103.02,54.76 C30.2
  Top 0.61: v147.96,13.97 v147.96,17.78 | v146.05,17.78 v146.05,13.97 | U$2.8 U$8.5 | v152.4,19.05 v148.59,19.05 v141.6,19.05
  Top 0.813: v92.71,29.84 v92.71,31.11 | C28.2 93.34,33.02 v92.71,32.38 v92.71,27.3 v92.71,26.04 v92.71,24.77 v92.71,23.5 v92.71,22.23 v92.71,19.68 v92.71,18.41 v92.71,17.14 93.34,16.51 C27.2 | C22.2 v135.09,17.3 v136.03,18.23 v136.03,19.68 C24.2 v136.03,22.23 v136.03,23.5 v136.03,24.77 v136.03,26.04 v136.03,27.3 C15.2 v136.03,29.84 v136.03,31.11 | C23.2 v135.3,32.02 | v135.3,32.02 136.03,31.3 v136.03,31.11 | v136.03,31.11 135.3,31.84 v135.3,32.02
  Top 1.016: R9.1 v120.86,8.43 120.86,9.43 C18.2 C19.2 v120.97,12.37 C20.2 | C9.2 v81.92,58.42 v81.92,57.15
  Bottom 0.152: 129.18,50.75 v129.13,50.7 | v117.12,58.06 v117.12,57.07 | v117.12,57.07 v117.12,56.1 | v114.99,56.1 112.7,56.1 | 112.7,56.1 v112.62,56.1 | v112.62,56.1 | v112.62,56.1 112.62,55.45 112.88,55.19 | 112.88,55.19 v112.95,55.12 | v112.95,55.12 v113.67,54.41 v114.99,54.41 116.23,54.41 v116.3,54.33 116.81,54.84 116.81,54.94 116.97,55.09 v117.12,55.09 | v117.12,56.1 117.2,56.03 117.2,55.09 v117.12,55.09 | v112.78,59.1 v112.78,58.06 | v112.78,58.06 112.78,57.99 | 112.78,57.99 v112.78,57.07 | v112.78,57.07 112.78,56.18 112.7,56.1 | v113.84,59.05 v114.99,59.05 v116.13,59.05 v117.12,59.05 | v117.12,59.05 | v117.12,59.05 v117.12,58.06 | v114.99,58.06 112.85,58.06 112.78,57.99 | v117.12,58.06 v116.13,58.06 v114.99,58.06 | v114.99,58.06 113.92,58.06 v113.88,58.02 112.82,58.02 v112.78,58.06 | v112.78,57.07 v113.92,57.07 v114.99,57.07 v116.2,57.07 v117.12,57.07 | v117.12,56.1 v116.2,56.1 v114.99,56.1 | v114.99,56.1 v113.92,56.1 | v113.92,56.1 | 112.88,55.19 113,55.19 | 113,55.19 v114.45,55.19 v115.59,55.19 | v115.59,55.19 117.02,55.19 v117.12,55.09 | 113,55.19 113,55.17 v112.95,55.12 | v117.12,55.09 115.7,55.09 v115.59,55.19 | v115.51,12.61 v114.54,11.64 | v114.54,11.64 114.54,12.12 | 114.54,12.12 114.54,12.48 v114.49,12.54 | 114.54,12.12 114.91,12.12 v115.52,11.51 114.68,11.51 v114.54,11.64
  Bottom 0.254: v131.44,60.28 131.44,59.05 | v120.02,59.67 120.02,59.69 | v127,60.28 127,59.69
  Bottom 0.3: v125.73,18.2 125.73,18.41 | v124.46,18.2 124.46,18.41 | v126.36,17.14 v126.36,15.88 | v147.17,60.47 145.52,60.47 v145.37,60.33
  Bottom 0.508: v223.65,9.98 v223.65,11.2
  other vias: 146.05,15.24 146.05,16.51 147.96,16.51 149.86,19.05 102.23,52.7 127.64,52.7
  pour Bottom (no thermals): 9.6,59.69 218.74,59.69 218.74,-4.45 8.26,-4.45 -2.54,6.35 -2.54,47.55
  pour Top (no thermals): 112.39,53.01 117.47,53.01 117.47,54.61 112.39,54.61
  pour Top (no thermals): 124.92,55.55 128.6,55.55 129.54,54.61 129.54,50.16 128.6,49.23 126.92,49.23 126.92,53.98 124.92,53.98
  pour Top (no thermals): 105.18,55.55 101.47,55.55 100.63,54.71 100.63,50.19 101.45,49.38 103.28,49.38 103.28,54.05 105.18,54.05
  pour Top (no thermals): 141.05,19.43 152.7,19.43 152.78,19.35 152.78,13.94 140.97,13.94 140.97,19.43
  pour Bottom: 218.85,18.82 223.11,18.82 224.26,17.68 224.26,-0.76 218.39,-0.76 218.39,18.36
  pour Top (no thermals): 123.52,18.59 126.8,18.59 126.8,15.85 126.49,15.54 124.05,15.54 123.9,15.54 123.52,15.93
HDRV
  Top 0.203: U$10.4 128.65,24.81 128.65,17.53 127.64,16.51 127.64,12.98 121.47,6.82 118.56,6.82 118.41,6.96 118.41,7.92 117.45,8.88 117.45,10.33 BOOST.13
IN_L_1
  Top 0.254: U1.59 141.18,64.98 139.24,63.04 117.71,63.04 115.8,61.13 MOTORDRIVER.41
IN_L_2
  Top 0.254: U1.58 140.68,65.12 139.01,63.45 117.55,63.45 115.3,61.21 MOTORDRIVER.42
IN_R_1
  Top 0.254: U1.57 140.18,66.14 140.18,65.96 140.16,65.94 140.16,65.24 138.77,63.86 117.38,63.86 114.8,61.28 MOTORDRIVER.43
IN_R_2
  Top 0.254: MOTORDRIVER.44 114.3,61.36 117.21,64.26 138.56,64.26 139.7,65.41 139.7,66.69 U1.56
LDRV  (via drill 0.35, 0.35 pad 0.6)
  Top 0.203: U$9.4 127.64,17.01 127.28,16.66 127.28,13.13 124.33,10.18 122.57,10.18 v122.56,10.16 | BOOST.8 113.49,10.62 v113.03,10.16
  Bottom 0.203: v122.56,10.16 121.92,9.53 113.67,9.53 v113.03,10.16
LED_B  (via drill 0.35)
  Top 0.254: U1.50 136.6,66.79 136.6,68.21 136.5,68.31 136.5,68.85 136.52,68.87 v136.52,69.22 | v147.32,53.98 147.32,52.49 R8.2 144.36,46.92 Q7.1
  Bottom 0.254: v136.53,69.22 v136.52,69.22 136.52,68.87 136.5,68.85 136.5,68.31 136.89,67.92 139.15,67.92 139.5,67.57 139.5,62.83 147.32,55.01 v147.32,53.98
LED_G  (via drill 0.35)
  Top 0.254: U1.51 137.18,68.56 v137.16,68.58 | v149.25,53.98 151.98,51.24 R48.2 151.98,46.92
  Bottom 0.254: v137.16,68.58 137.51,68.58 137.53,68.56 138.07,68.56 138.09,68.58 139.06,68.58 139.91,67.74 139.91,63 148.32,54.59 148.63,54.59 v149.25,53.98
LED_R  (via drill 0.35)
  Top 0.254: U1.52 137.68,68.17 137.82,68.31 137.82,68.85 137.8,68.87 v137.8,69.22 | v148.59,55.24 148.59,49.95 R7.2 148.17,46.92 Q5.1
  Bottom 0.254: v137.79,69.22 v137.8,69.22 139.06,69.22 140.31,67.97 140.31,67.71 140.34,67.68 140.34,63.17 148.26,55.24 v148.59,55.24
LO1
  Top 0.3: MOTORDRIVER.47 112.8,60.77 112.56,61.01 108.75,61.01 R2.1 108.58,62.23 TP_LO1.P$1
LO2
  Top 0.3: MOTORDRIVER.48 107.31,60.33 106.68,60.96 R1.1 106.68,62.23 TP_LO2.P$1
MOTOR_L+  (via drill 0.35, 0.5)
  Top 0.254: CURRENTAMP.2 156.29,67.39 136.3,47.4 129.22,47.4 128.35,46.53 128.35,45.92 v127.64,45.21
  Top 0.3: MOTOR_LR.2 v111.12,44.45
  Top 1.016: MOTOR_LR.2 111.12,41.27 109.86,40.01 109.86,36.83 110.49,36.2 MOTOR_L.1
  Bottom 0.254: v111.12,44.45 111.88,45.21 v127.64,45.21
MOTOR_L+_HIGH  (via drill 0.35, 0.5)
  Top 0.254: CURRENTAMP.3 156.79,67.26 136.53,46.99 129.74,46.99 v129.01,46.25
  Top 0.3: MOTOR_LR.1 v111.12,46.99 | 112.55,52.7 112.55,53.12 MOTORDRIVER.14 MOTORDRIVER.13 112.3,52.93 112.54,52.69
  Top 0.508: MOTORDRIVER.13 112.55,53.13 112.55,52.7
  Top 1.016: 112.54,52.69 112.39,52.55 112.39,49.89 MOTOR_LR.1
  Bottom 0.254: v111.12,46.99 112.08,46.04 128.79,46.04 v129.01,46.25
MOTOR_L-
  Top 0.3: MOTORDRIVER.18 MOTORDRIVER.17
  Top 0.305: MOTORDRIVER.18 114.53,53.11
  Top 0.61: 114.53,53.11 114.53,53.1 114.53,52.3 114.05,52.3
  Top 1.016: 114.05,52.3 113.67,51.92 113.67,40.01 MOTOR_L.2
MOTOR_L_CUR
  Top 0.254: U1.8 146.61,72.14 147.35,71.39 151.92,71.39 R3.2
  Top 0.3: R3.2 C1.1
MOTOR_R+  (via drill 0.35, 0.5)
  Top 0.254: CURRENTAMP.8 156.79,73.14 157.95,71.98 159.09,71.98 159.61,71.46 159.61,68.81 137.01,46.21 v131.37,46.21
  Top 0.3: MOTOR_RR.2 v118.75,44.45
  Top 1.016: MOTOR_RR.2 118.75,41.27 120.02,40.01 120.02,36.83 119.38,36.2 MOTOR_R.2
  Bottom 0.254: 122.56,44.45 129.61,44.45 v131.37,46.21
  Bottom 0.3: v118.75,44.45 122.56,44.45
MOTOR_R+_HIGH  (via drill 0.35, 0.5)
  Top 0.254: CURRENTAMP.7 157.29,73.21 158.12,72.39 159.26,72.39 160.02,71.63 160.02,68.58 136.99,45.55 130.18,45.55 v130.18,46.25
  Top 0.3: MOTOR_RR.1 v118.75,46.99 | MOTORDRIVER.23 MOTORDRIVER.24
  Top 0.508: MOTORDRIVER.24 117.55,53.13 117.55,52.6
  Top 1.016: 117.55,52.6 117.55,49.81 MOTOR_RR.1
  Bottom 0.254: 120.02,46.99 129.43,46.99 v130.18,46.25
  Bottom 0.3: v118.75,46.99 120.02,46.99 120.23,46.99
MOTOR_R-
  Top 0.305: MOTORDRIVER.20 115.57,53.38 MOTORDRIVER.19
  Top 0.6: 115.93,52.32 115.57,52.68 115.57,53.38
  Top 1.016: 115.93,52.32 116.2,52.05 116.2,40.01 MOTOR_R.1
MOTOR_R_CUR
  Top 0.254: U1.9 146.68,72.64 147.52,71.79 150.95,71.79 R4.2
  Top 0.3: 152.09,74.93 C2.1 R4.2
MUX0
  Top 0.305: XLINE.4 116.85,94.17 127.93,94.17 136.28,85.81 138.69,85.81 139.18,85.31 U1.26
MUX1
  Top 0.305: XLINE.5 117.9,94.62 128.12,94.62 136.47,86.27 138.88,86.27 139.68,85.46 U1.25
MUX2
  Top 0.305: XLINE.6 118.94,95.08 128.33,95.08 136.69,86.72 139.06,86.72 140.18,85.61 U1.24
MUX3
  Top 0.305: U1.23 140.68,85.75 139.25,87.18 136.95,87.18 128.6,95.54 119.98,95.54 XLINE.7
N$1  (via drill 0.35)
  Top 0.254: 68.63,61.64 v79.02,61.64 | v86.36,61.59 99.59,61.59 103.47,65.48 106.98,65.48 108.8,67.3 R21.2 107.1,69.01 R35.2
  Top 0.3: 68.63,61.64 59.74,52.76 59.74,19.28 58.72,18.25 19.68,18.25 15.78,14.35 BTN_SEL.2 BTN_SEL.1
  Bottom 0.254: v86.36,61.59 85.56,61.59 85.45,61.71 79.8,61.71 79.74,61.64 v79.02,61.64
N$2
  Top 0.203: BOOST.10 114.74,9.96 113.67,8.89 C14.1
N$3
  Top 0.3: C10.1 81.92,70.56 BUCK.8
N$4
  Top 0.3: R5.1 84.03,70.27 R6.2 84.78,69.31 BUCK.6
N$7
  Top 0.254: CURRENTAMP.9 156.29,73.68 156.31,73.66 156.31,73.13 156.21,73.03 R4.1
N$8
  Top 0.254: R3.1 155.57,71.12 155.79,70.9 CURRENTAMP.1
N$11
  Top 0.203: BOOST.1 116.17,13.97 116.84,13.97 117.81,13.01 117.81,9.03 119.17,7.67 R9.2
N$12
  Top 0.203: BOOST.2 115.24,14.27 115.57,14.61 116.84,14.61 118.16,13.28 118.16,10.57 119.06,9.67 C18.1
N$13
  Top 0.203: C19.1 120.06,12.43 120.06,14.19 120.86,14.99 R10.1
N$16
  Top 0.203: BOOST.11 115.24,8.9 C21.2
N$18
  Top 0.203: RSENSE.2 103.5,22.5 103.5,17.21 R14.2
  pour Top (no thermals): 104.78,26.67 111.12,26.67 111.12,22.86 104.78,22.86
N$19  (via drill 0.35, 0.35 pad 0.6)
  Top 0.203: C21.1 116.57,7.67 116.57,9.32 115.74,10.16 BOOST.12 116.12,10.16 v116.72,10.16 | U$9.9 123.19,18.74 123.19,12.06 v122.56,11.43
  Top 0.813: U$9.5 U$9.6
  Bottom 0.203: v122.56,11.43 121.01,9.88 117,9.88 v116.72,10.16
  pour Top (no thermals): 118.92,26.37 127,26.37 127,19.13 118.92,19.13
N$20  (via drill 0.35)
  Top 0.203: R12.1 129.54,13.34 | 129.54,13.34 R11.2 | BOOST.4 114.33,13.64 114.33,14.51 116.34,16.51 121,16.51 122.56,14.96 v122.56,12.7 | v125.73,9.53 129.54,13.34
  Bottom 0.203: v122.56,12.7 v125.73,9.53
N$22
  Top 0.203: BOOST.5 111.05,12.79 C26.2 109.65,12.76 R14.1
N$23
  Top 0.203: BOOST.6 112.45,12.29 C26.1 109.65,10.86 R15.1
N$26
  Top 0.305: SW1.B4 81.5,75.56 81.39,75.46 | 81.39,75.46 R16.2 | R17.2 80.86,75.98 81.39,75.46
N$27
  Top 0.3: IMU-BNO055.11 156.51,82.86 156.51,82.48 157.48,81.51 R27.1
N$28
  Top 0.3: MOTORDRIVER.32 118.53,57.15 | 118.53,57.15 MOTORDRIVER.31 | 118.53,57.15 119.16,57.78 129.75,57.78 R22.2 128.75,60.9 R23.1
N$30
  Top 0.3: IMU-BNO055.9 155.46,82.02 C42.1
N$31
  Top 0.254: MOTORDRIVER.35 118.94,59.1 119.19,58.85 120.66,58.85 COSC.1
  Top 0.3: 120.91,59.1 COSC.1 ROSC.1
N$33
  Top 0.254: Q8.3 56.4,77.89 U$5.+ 56.39,79.65 U$1.-
N$34
  Top 0.305: SW1.B3 81.96,78.74 R13.1 R18.2
N$37
  Top 0.3: IMU-BNO055.4 153.91,84.16 153.53,84.16 152.56,83.19 R26.1
N$38
  Top 0.3: R32.2 195.91,8.68 198.12,6.46 LED2.C
N$40
  Top 0.254: R36.2 147.32,37.53 LED1.3
N$41  (via drill 0.35, 0.5)
  Top 0.3: R37.1 185.98,16.8 153.67,16.8 v153.67,13.76 U$8.4 | v146.97,13.13 146.33,12.49 U$2.4
  Bottom 0.3: v146.97,13.13 147.94,13.13 147.93,13.12 153.03,13.12 v153.67,13.76
N$42
  Top 0.254: R38.2 149.86,39.15 LED1.4
N$43
  Top 0.254: R40.2 145.75,39.46 LED1.2
N$45
  Top 0.254: Q5.3 R36.1
N$46
  Top 0.254: R38.1 151.09,43.35
N$47
  Top 0.3: R39.2 R37.2 192.42,8.66 BATT_SWITCH.5 BATT_SWITCH.2
N$48
  Top 0.254: Q7.3 144.74,42.12 R40.1
N$54
  Top 0.3: U1.31 136.68,78.63 136.68,78.64 136.68,78.92 137.79,80.03 C36.1
N$72
  Top 0.3: U1.47 131.58,69.14 C38.1
PWM_FAN_L  (via drill 0.35)
  Top 0.254: U1.37 134.18,74.22 133.41,74.22 133.25,74.38 133.25,76.2 v132.72,76.2 | v76.17,62.38 76.17,71.73 v76.83,72.39 | v76.2,59.05 76.2,52.19 PWM_FAN_L.1
  Bottom 0.254: v132.72,76.2 132.35,76.57 101.33,76.57 98.89,74.13 98.89,73.96 96.05,71.12 78.11,71.12 v76.83,72.39 | v76.17,62.38 76.17,59.08 v76.2,59.05
PWM_FAN_R  (via drill 0.35)
  Top 0.254: PWM_FAN_R.1 149.22,55.77 v149.22,56.52 | v140.97,67.98 135.31,73.64 U1.38
  Bottom 0.254: v149.22,56.52 147.19,58.55 145.63,58.55 140.97,63.2 v140.97,67.98
PWM_L
  Top 0.254: MOTORDRIVER.39 116.8,60.92 118.11,62.23 140.97,62.23 142.68,63.94 U1.62
PWM_R
  Top 0.254: MOTORDRIVER.40 116.3,61.06 117.88,62.64 140.74,62.64 142.24,64.14 142.24,66.66 U1.61
RX  (via drill 0.35)
  Top 0.254: 94.61,78.74 93.98,78.74 92.9,79.82 85.96,79.82 SW1.B1 81.79,83.99 81.79,87.63 UART_CONNECTOR.1
  Top 0.3: R41.2 82.58,87.63 81.79,87.63
  Top 0.305: U1.43 131.4,71.14 123.16,79.38 122.56,79.38 v121.92,78.74 | 94.4,78.74 94.61,78.74 v116.84,78.74
  Bottom 0.305: v116.84,78.74 v121.92,78.74
RX_BT
  Top 0.254: BT_HC05.3 94.59,83.19 SW1.A1
SCL  (via drill 0.35)
  Top 0.152: 135.89,93.34 136.49,92.75 138.82,92.75 139.04,92.96
  Top 0.254: 135.89,93.34 v133.35,93.34 | 139.04,92.96 144.75,92.96 v144.78,92.98 | v159.52,85.45 159.28,85.2 IMU-BNO055.19
  Top 0.305: OLED_DISPLAY.3 116.84,91.71 R31.2 117.69,86.36 119.38,86.36 124.46,81.28 124.46,79.36 131.69,72.14 U1.41
  Bottom 0.254: v144.78,92.98 145.03,92.73 145.05,92.73 145.3,92.48 157.01,92.48 160.04,89.45 160.04,85.97 v159.52,85.45
  Bottom 0.3: OLED_DISPLAY.3 117.39,93.34 v133.35,93.34
SDA  (via drill 0.35)
  Top 0.152: 135.89,92.08 136.26,92.44 138.7,92.44 139.06,92.08
  Top 0.254: 135.89,92.08 v133.35,92.08 | 139.06,92.08 v144.78,92.08 | v159.38,86.36 159.03,86 IMU-BNO055.20
  Top 0.3: OLED_DISPLAY.4 128.09,92.25 v128.27,92.08
  Top 0.305: OLED_DISPLAY.4 118.75,92.17 R30.2 119.8,87.21 125.09,81.92 125.09,79.38 131.84,72.64 U1.40
  Bottom 0.254: v159.38,86.36 159.38,89.53 156.84,92.08 v144.78,92.08
  Bottom 0.3: v128.27,92.08 v133.35,92.08
SDIO_CK  (via drill 0.35)
  Top 0.254: v137.16,65.41 137.46,65.7 137.94,65.7 138.18,65.94 U1.53 | v131.59,74.44 131.24,74.44 125.93,79.75 125.93,82.26 120.42,87.77 120.42,88.2 119.7,88.92 119.68,88.92 v119.43,89.17 | SD_CARDHOLDER.5 69.01,90.56 71.41,92.96 84.76,92.96 90.02,98.22 102.69,98.22 108.95,91.97 108.97,91.97 v109.22,91.71
  Bottom 0.254: v137.16,65.41 136.19,65.41 129.69,71.91 129.69,72.54 v131.59,74.44 | v119.43,89.17 119.18,88.92 119.16,88.92 118.9,88.67 111.99,88.67 109.88,90.78 109.88,91.08 109.49,91.46 109.47,91.46 v109.22,91.71
SDIO_CMD  (via drill 0.35)
  Top 0.254: U1.54 138.68,65.32 v138.28,64.92 | v130.93,75.68 130.69,75.68 126.36,80.01 126.34,80.01 126.34,82.43 120.83,87.94 120.83,88.7 119.43,90.1 v119.43,90.17 | v109.22,92.62 103.21,98.63 89.85,98.63 84.62,93.4 71.17,93.4 66.89,89.11 SD_CARDHOLDER.3
  Bottom 0.254: v138.28,64.92 137.6,64.92 137.43,64.75 136.25,64.75 128.91,72.09 128.91,73.66 v130.93,75.68 | v119.43,90.17 118.34,89.08 112.39,89.08 110.28,91.19 110.28,91.25 109.88,91.65 109.88,91.99 109.49,92.37 109.47,92.37 v109.22,92.62
SDIO_D0  (via drill 0.35)
  Top 0.254: U1.39 131.97,73.14 125.53,79.58 125.53,82.09 120.02,87.61 120.02,87.68 v119.43,88.27 | SD_CARDHOLDER.7 71.12,87.8 71.12,88.19 71,88.31 71,91.96 71.58,92.53 84.91,92.53 90.2,97.82 102.19,97.82 108.95,91.06 108.97,91.06 v109.22,90.81
  Bottom 0.254: v119.43,88.27 111.76,88.27 v109.22,90.81
SWCLK  (via drill 0.35)
  Top 0.254: U1.49 136.18,65.7 135.15,64.67 103.81,64.67 99.47,60.33 v84.62,60.33 | v80.64,60.33 70.37,60.33 70.37,60.29
  Top 0.3: 70.37,60.33 68.59,60.33 60.65,52.38 60.65,18.9 59.1,17.35 30.69,17.35 21.59,8.25 21.59,6.39 DEBUG_CONNECTOR.1
  Bottom 0.254: v84.62,60.33 v80.64,60.33
SWDIO  (via drill 0.35)
  Top 0.254: U1.46 135.14,69.64 135.28,69.49 135.28,68.58 135.27,68.57 135.27,68.38 135.1,68.21 133.16,68.21 132.72,67.76 132.72,65.54 132.25,65.08 103.64,65.08 99.3,60.73 85.5,60.73 v85.18,61.05 | v80.01,60.98 79.99,60.96 69.16,60.96
  Top 0.3: 69.16,60.96 68.59,60.96 60.2,52.57 60.2,19.09 58.91,17.8 30.5,17.8 DEBUG_CONNECTOR.2
  Bottom 0.254: v85.18,61.05 85.11,60.98 v80.01,60.98
TX
  Top 0.254: 95.14,76.31 92.04,79.41 85.8,79.41 84.56,80.64 SW1.B2 82.55,80.64 79.38,83.82 79.38,87 UART_CONNECTOR.2
  Top 0.3: R42.2 78.96,86.58 79.38,87 | 118.22,76.31 116,74.09 100.54,74.09 98.74,75.89 98.31,76.31 95.14,76.31
  Top 0.305: U1.42 131.54,71.64 123.12,80.06 121.97,80.06 118.22,76.31
TX_BT  (via drill 0.35)
  Top 0.254: v96.42,79.48 95.25,80.64 SW1.A2
  Bottom 0.254: BT_HC05.2 96.42,78.81 v96.42,79.48
V+
  Top 0.203: RSENSE.1 102.23,22.5 102.23,15.94 R15.2
  Top 0.254: 178.75,73.34 173.35,78.74 R43.1
  Top 0.3: 109.22,6.99 109.22,5.08 | BATT_SWITCH.6 BATT_SWITCH.3 | BATT_SWITCH.3 196.86,4.96 LED2.A | 178.75,73.34 178.75,61.28 170.71,53.23 170.71,19.46 171.65,18.52 218.99,18.52 222.88,14.62 222.88,2.54 222.25,1.91 193.8,1.91 | BATT_SWITCH.3 193.8,1.91 | 193.8,1.91 160.02,1.91
  Top 0.305: BOOST.7 113.03,11.79 112.98,11.74 112.96,11.74 112.35,11.13 112.35,10.16 110.82,8.64 C13.1 | 109.22,6.99 109.22,8.42 C13.1 | R15.2 109.43,8.74 C13.1
  Top 0.508: BUCK.2 83.72,66.89 | 83.72,66.89 BUCK.1 | 83.72,66.89 83.34,66.52 C9.1
  Top 1.27: 83.34,66.52 83.34,64.27 83.45,64.16 83.45,23.23 96.52,10.16
  Top 4: FAN_POWER_R.POS+ 99.06,3.42 | 99.06,3.42 137.03,3.42 FAN_POWER_L.POS+ | 99.06,3.42 | 99.06,3.42 98.42,4.05
  Bottom 4: FAN_POWER_R.POS+ 137.03,3.42 FAN_POWER_L.POS+ | FAN_POWER_R.POS+
  pour Top (no thermals): 95.25,33.66 95.25,3.17 101.6,3.17 101.6,29.21 97.16,33.66
  pour Top (no thermals): 160.02,15.88 164.47,15.88 164.47,5.71 159.38,0.64 135.25,0.64 135.25,5.71 154.31,5.71 160.02,11.43
VCC5V  (via drill 0.35)
  Top 0.254: ROSC.2 123.53,60.25 v124.69,60.25 125.57,60.25 CVCC.1
  Top 0.3: MOTORDRIVER.33 118.53,58.42 | 118.53,58.42 MOTORDRIVER.34 | 118.53,58.42 125.31,58.42 CVCC.1 | R1.2 R2.2 108.71,59.6 v110.49,59.6 MOTORDRIVER.1 | R23.2 CVCC.1 | 126.23,59.48 CVCC.1 | 123.19,59.7 ROSC.2
  Bottom 0.254: v124.69,60.25 124.62,60.33 111.21,60.33
  Bottom 0.3: v110.49,59.6 111.21,60.33
VOLTM_BATT  (via drill 0.35)
  Top 0.254: 143.73,78.11 U1.17 | 161.07,78.11 161.18,78.21 R43.2 R44.1
  Top 0.3: 161.18,78.21 160.44,77.47 v160.02,77.47 | v148.59,78.11 147.62,78.11 147.6,78.13 143.75,78.13 143.73,78.11
  Bottom 0.3: v160.02,77.47 151.97,77.47 151.36,78.07 148.62,78.07 v148.59,78.11
VOLTM_BOOST  (via drill 0.35)
  Top 0.3: R46.1 R45.2 147.93,64.33 v147.93,66.67 | v147.32,77.45 146.01,76.14 U1.16
  Bottom 0.3: v147.93,66.67 147.96,66.7 147.96,76.83 147.93,76.83 v147.32,77.45
VREF  (via drill 0.35)
  Top 0.254: LDO_VREF_1V8.8 160.89,71.33 v160.68,71.12 | v158.75,70.48 158.37,70.48 CURRENTAMP.5
  Top 0.3: LDO_VREF_1V8.7 160.57,71.83 | 160.57,71.83 158.2,74.21 CURRENTAMP.6 159.38,74.21 | LDO_VREF_1V8.8 161.07,71.33 160.57,71.83 | C16.1 160.89,74.21 159.38,74.21 | TP_1V8.P$1 159.38,74.21
  Bottom 0.254: v160.68,71.12 159.38,71.12 v158.75,70.48
XLINE
  Top 0.305: XLINE.3 115.81,93.71 127.74,93.71 136.09,85.35 138.5,85.35 138.68,85.17 U1.27

## Text on the board
tPlace: GND | MUX3 | RX | TX | GND | BT_RX | BT_TX | B0_ON | B1_ON | SELECT | GND | RESET | SWDIO | SWCLK | OFF | ON
_tNames: . | --> | X | <-- | Y | https://github.com/caselabbet/robotsm20-linefollower | 1V8 | . | . | . | . | 3V3 | 5V | . | - | - | 12V | GND | PWM | PWM | GND | . | NC | Blitz V2 / rev 1.0 / 2020-03-13 / Isak Åslund / & / Oskar Johansson / Board 19/02 | ENC-A | ENC-I | ENC-B | GND | 5V | - | - | 5V | GND | ENC-B | ENC-I | ENC-A | NC | - | - | BAT- | V+